# Altium schematic sheet USB module.SchDoc
size A4; Organization: Altium Limited; Address1: L3, 12a Rodborough Rd; Address2: Frenchs Forest; Address3: NSW; Address4: Australia 2086
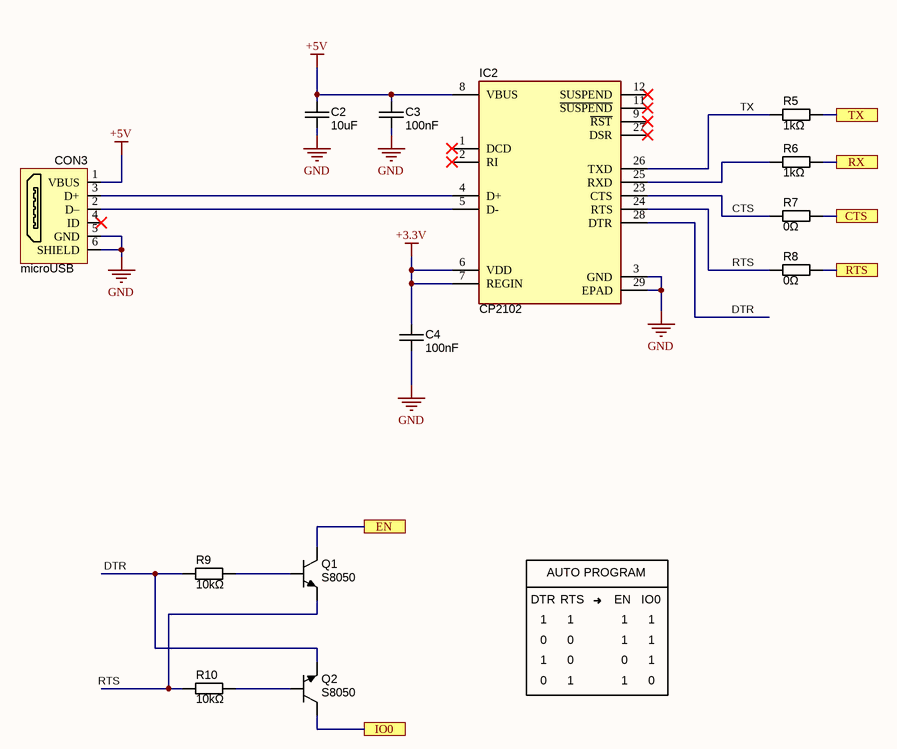
[diagram p0: USB module.SchDoc]

## Parts
C2  value 10uF  [CAPC1608N]  (hidden comment: approved sub OK)
C3  value 100nF  [CAPC1608N]  (hidden comment: approved sub OK)
C4  value 100nF  [CAPC1608N]  (hidden comment: approved sub OK)
CON3  microUSB  [micro-USB-HRS-ZX62D-B-5PA8]
IC2  CP2102  [QFN50P500X500X100-29N-D]
Q1  Manufacturer Part Number 1: S8050  [SOT23-3]  (hidden comment: NPN_S8050)
Q2  Manufacturer Part Number 1: S8050  [SOT23-3]  (hidden comment: NPN_S8050)
R5  value 1kΩ  [RESC1608N]  (hidden comment: Thick Film)
R6  value 1kΩ  [RESC1608N]  (hidden comment: Thick Film)
R7  value 0Ω  [RESC1608N]  (hidden comment: Thick Film)
R8  value 0Ω  [RESC1608N]  (hidden comment: Thick Film)
R9  value 10kΩ  [RESC1608N]  (hidden comment: Thick Film)
R10  value 10kΩ  [RESC1608N]  (hidden comment: Thick Film)

## Ports
CTS, EN, IO0, RTS, RX, TX

## Nets
+3.3V: C4.2 IC2.6(VDD) IC2.7(REGIN)
+5V: C2.2 C3.2 CON3.1(VBUS) IC2.8(VBUS)
GND: C2.1 C3.1 C4.1 CON3.5(GND) CON3.6(SHIELD) IC2.3(GND) IC2.29(EPAD)
CTS: IC2.23(CTS) R7.2
CTS: R7.1 ; port CTS  [a separate net that carries the same name]
DTR: IC2.28(DTR) Q2.2(E) R9.2
EN: Q1.3(C) ; port EN
IO0: Q2.3(C) ; port IO0
RTS: IC2.24(RTS) Q1.2(E) R8.2 R10.2
RTS: R8.1 ; port RTS  [a separate net that carries the same name]
RX: R6.1 ; port RX
TX: IC2.26(TXD) R5.2
TX: R5.1 ; port TX  [a separate net that carries the same name]
NetCON3_2: CON3.2(D–) IC2.5(D-)
NetCON3_3: CON3.3(D+) IC2.4(D+)
NetIC2_25: IC2.25(RXD) R6.2
NetQ1_1: Q1.1(B) R9.1
NetQ2_1: Q2.1(B) R10.1

Not connected (* = marked no-connect by the designer): CON3 4(ID)*; IC2 1(DCD)* 2(RI)* 9(~{RST})* 11(~{SUSPEND})* 12(SUSPEND)* 27(DSR)*

## Notes on the sheet
- DTR
- 1
- AUTO PROGRAM
- RTS
- EN
- IO0
- 0
- Title
- Size:
- Date:
- A4
- Number:
- Time:
- Revision:
- Sheet
- of
- File:

## Library data of the parts
C2-C4 = CAPC_1u_0603: Capacitor SMD Cer 1uF 10% 16V X7R 0603; Manufacturer 1: TDK Corporation; Manufacturer Part Number 1: C1608X7R1C105K; Ratings: 16V; X7R; Material: ceramic; Package / Case: 0603 (1608 metric); Tolerance: ±10%; Supplier 1: Digi-Key; Supplier Part Number 1: 445-1604-1-ND
CON3 = microUSB-B-socket (HIROSE ZX62D-B-5PA8): micro USB-B socket (HIROSE ZX62D-B-5PA8); pin to pad: 6>0; Supplier 1: Farnell; ComponentLink1URL: http://www.farnell.com/datasheets/1693470.pdf; ComponentLink1Description: http://www.farnell.com/datasheets/1693470.pdf; Supplier Part Number 1: 2300438
IC2 = CP2102: Integrated Circuit; Manufacturer_Name: Silicon Labs; Datasheet Link: https://componentsearchengine.com/Datasheets/1/CP2102.pdf; Height: 1mm; Manufacturer_Part_Number: CP2102; Mouser Part Number: 634-CP2102; Mouser Price/Stock: https://www.mouser.co.uk/ProductDetail/Silicon-Labs/CP2102?qs=ucY0lxHzU7615lOm95XT0w%3D%3D
Q1 Q2 = NPN_S8050: Transistor SMD NPN 40V 0.2A 350mW SOT-23; Manufacturer 1: Fairchild Semiconductor; Ratings: 40V; 200mA; 350mW; Material: Si; Package / Case: SOT-23; Supplier 1: Digi-Key; Supplier Part Number 1: MMBT3904FSCT-ND; Transistor Type: NPN; Mounting Type: Surface Mount
R5-R10 = RES_1K5_0603_5%: Resistor SMD chip 1.5k Ohm 0.1W 5% 0603; Manufacturer 1: Yageo; Manufacturer Part Number 1: RC0603JR-071K5L; Ratings: 1/10 W; Package / Case: 0603 (1608 metric); Tolerance: ±5%; Material: thick film; Supplier 1: Digi-Key; Supplier Part Number 1: 311-1.5KGRCT-ND